# EAGLE design ML_Interface_ExtenderB (EAGLE 8.6.1)
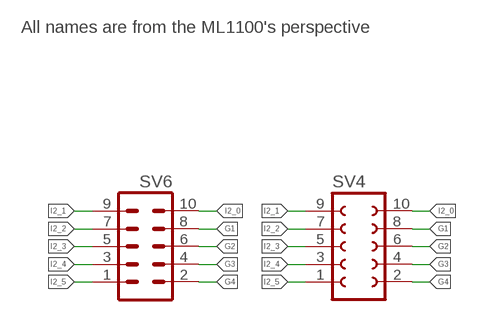
[diagram p0: schematic, sheet 1]

## Parts
SV4  FE05-2W  [FE05-2W]
SV6  MA05-2  [MA05-2]

## Nets
G1: SV4.8 SV6.8
G2: SV4.6 SV6.6
G3: SV4.4 SV6.4
G4: SV4.2 SV6.2
I2_0: SV4.10 SV6.10
I2_1: SV4.9 SV6.9
I2_2: SV4.7 SV6.7
I2_3: SV4.5 SV6.5
I2_4: SV4.3 SV6.3
I2_5: SV4.1 SV6.1

## Notes on the sheet
- All names are from the ML1100's perspective

## Library data of the parts
SV4 = con-lsta:FE05-2W: FEMALE HEADER; OC_FARNELL: unknown; OC_NEWARK: unknown
SV6 = con-lstb:MA05-2: PIN HEADER; OC_FARNELL: unknown; OC_NEWARK: unknown

## Net classes
0 default: width 0.203 mm
1 ground: width 0.61 mm
2 signal_out: width 0.254 mm, clearance 0.152 mm

## Board
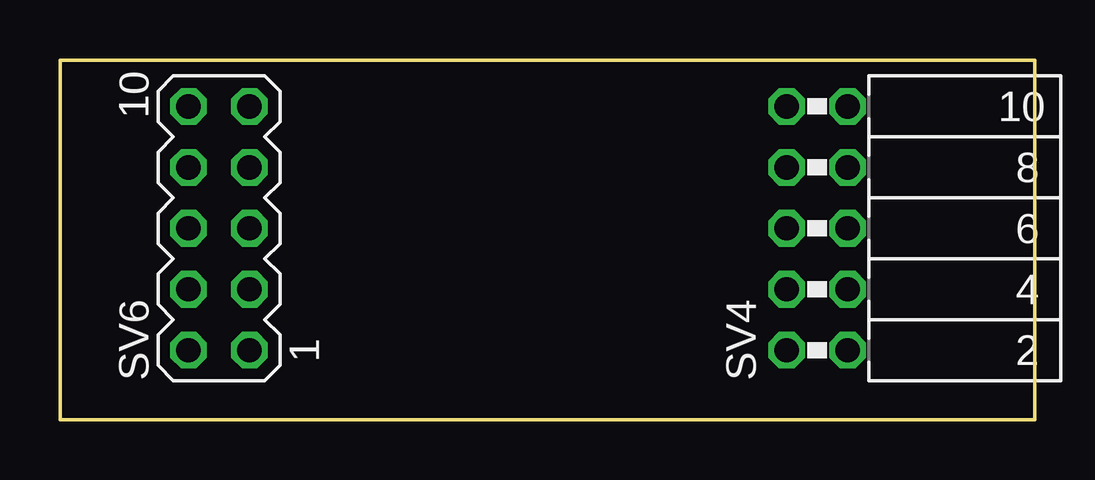
[diagram p1: board, top side]
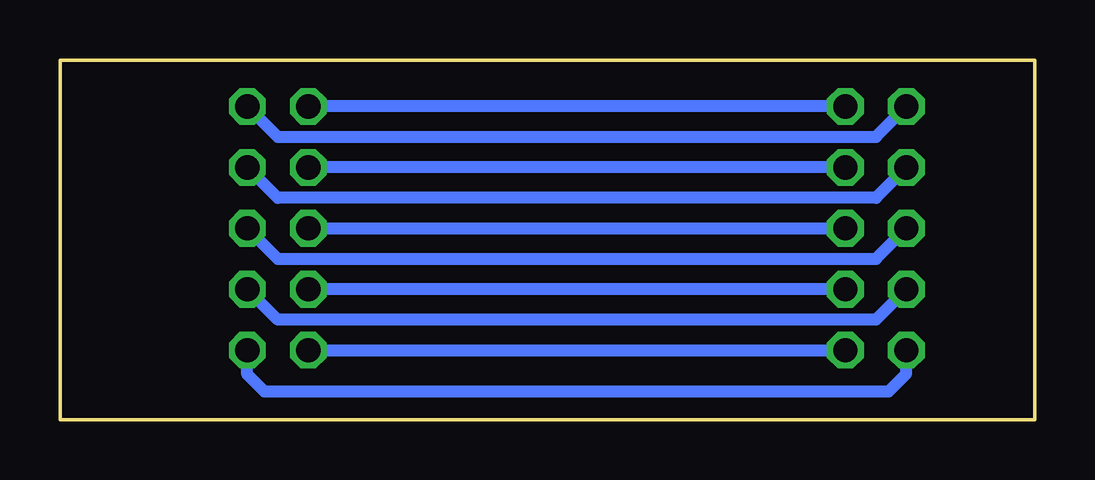
[diagram p2: board, bottom side, seen from below]

Size 40.64 x 14.99 mm. Coordinates in mm from the lower left corner, seen from the top.
Outline: 40.64,0 0,0 0,14.99 40.64,14.99 40.64,0
Copper layers (1*16): Top 0.035mm / dielectric 1.5mm / Bottom 0.035mm
Design rules "default *": minimum track width 10mil, minimum drill 0.35mm, track to track 10mil, track to pad 10mil, pad to pad 10mil, via to via 10mil, smd to smd 10mil, copper to edge 1mil, drill to drill 6mil, minimum pad ring 10mil, minimum via ring 8mil, stop-mask expansion 4mil, vias tented up to drill 0mil, thermal gap 10mil

### Footprints (pad centres in the part's own frame; a part is rotated, then mirrored left to right if it is on the bottom)
FE05-2W = drill 1.016 octagon: 1 -5.08,1.27; 2 -5.08,-1.27; 3 -2.54,1.27; 4 -2.54,-1.27; 5 0,1.27; 6 0,-1.27; 7 2.54,1.27; 8 2.54,-1.27; 9 5.08,1.27; 10 5.08,-1.27
MA05-2 = drill 1.016 octagon: 1 -5.08,-1.27; 2 -5.08,1.27; 3 -2.54,-1.27; 4 -2.54,1.27; 5 0,-1.27; 6 0,1.27; 7 2.54,-1.27; 8 2.54,1.27; 9 5.08,-1.27; 10 5.08,1.27

### Placement (x,y rotation side)
SV4  31.56,7.97 90 top
SV6  6.63,7.97 90 top

### Tracks (layer width: path | path; a pad name or v marks a point on that pad's centre or on a via)
G1
  Bottom 0.508: SV6.8 6.63,9.24 31.56,9.24 SV4.8
G2
  Bottom 0.508: SV4.6 31.56,6.7 6.63,6.7 SV6.6
G3
  Bottom 0.508: SV6.4 6.63,4.16 31.56,4.16 SV4.4
G4
  Bottom 0.508: SV4.2 32.83,1.89 32.13,1.18 6.09,1.18 5.36,1.91 SV6.2
I2_0
  Bottom 0.508: SV4.10 31.56,11.78 6.63,11.78 SV6.10
I2_1
  Bottom 0.508: SV6.9 SV4.9
I2_2
  Bottom 0.508: SV6.7 SV4.7
I2_3
  Bottom 0.508: SV4.5 SV6.5
I2_4
  Bottom 0.508: SV6.3 SV4.3
I2_5
  Bottom 0.508: SV4.1 SV6.1